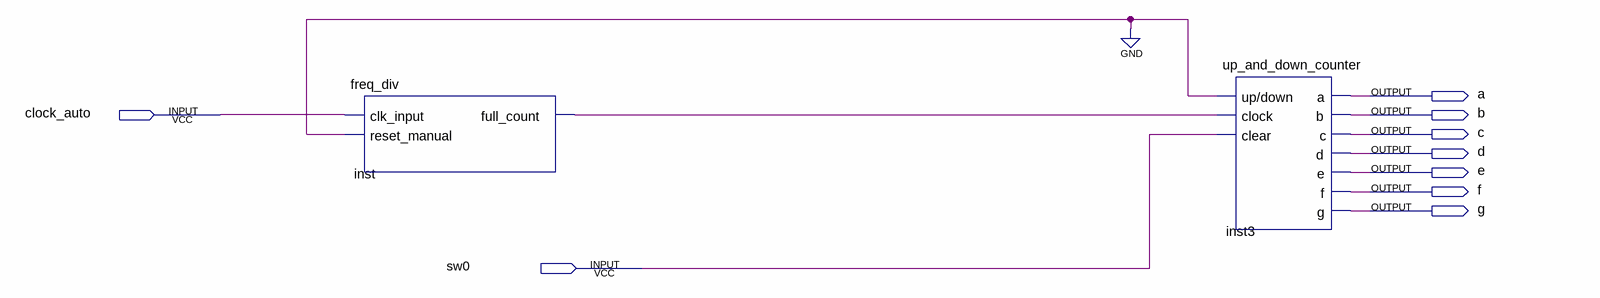
[diagram p0: schematic sheet]
// Quartus schematic automatic_counter.bdf as structural Verilog: 2 symbols, 9 pins
module automatic_counter (
  input  clock_auto,
  input  sw0,
  output a,
  output b,
  output c,
  output d,
  output e,
  output f,
  output g
);

  wire inst_full_count;

  freq_div inst (.clk_input(clock_auto), .reset_manual(1'b0), .full_count(inst_full_count));
  up_and_down_counter inst3 (
    .\up/down (1'b0), .clock(inst_full_count), .clear(sw0), .a(a), .b(b), .c(c), .d(d), .e(e), .f(f), .g(g));
endmodule
